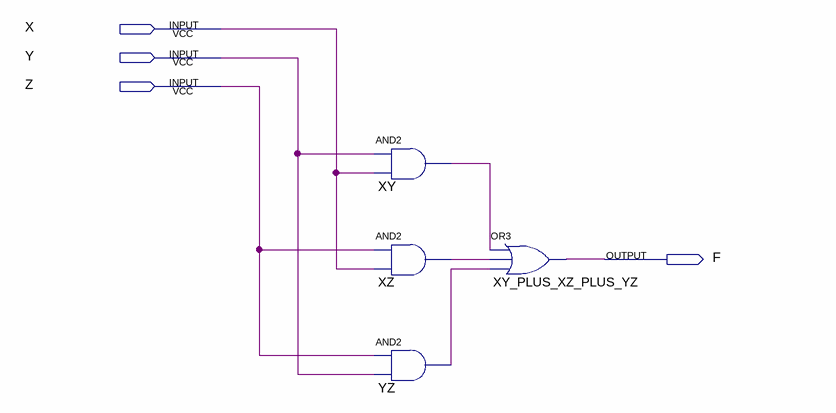
[diagram p0: schematic sheet]
// Quartus schematic Project.bdf as structural Verilog: 4 symbols, 4 pins
module Project (
  input  X,
  input  Y,
  input  Z,
  output F
);

  wire XY_out, XZ_out, YZ_out;

  and XY (XY_out, Y, X);
  and XZ (XZ_out, Z, X);
  and YZ (YZ_out, Z, Y);
  or XY_PLUS_XZ_PLUS_YZ (F, XY_out, XZ_out, YZ_out);
endmodule
